# Altium schematic sheet MCU_Hydro.SchDoc
size A4; SheetNumber: 6
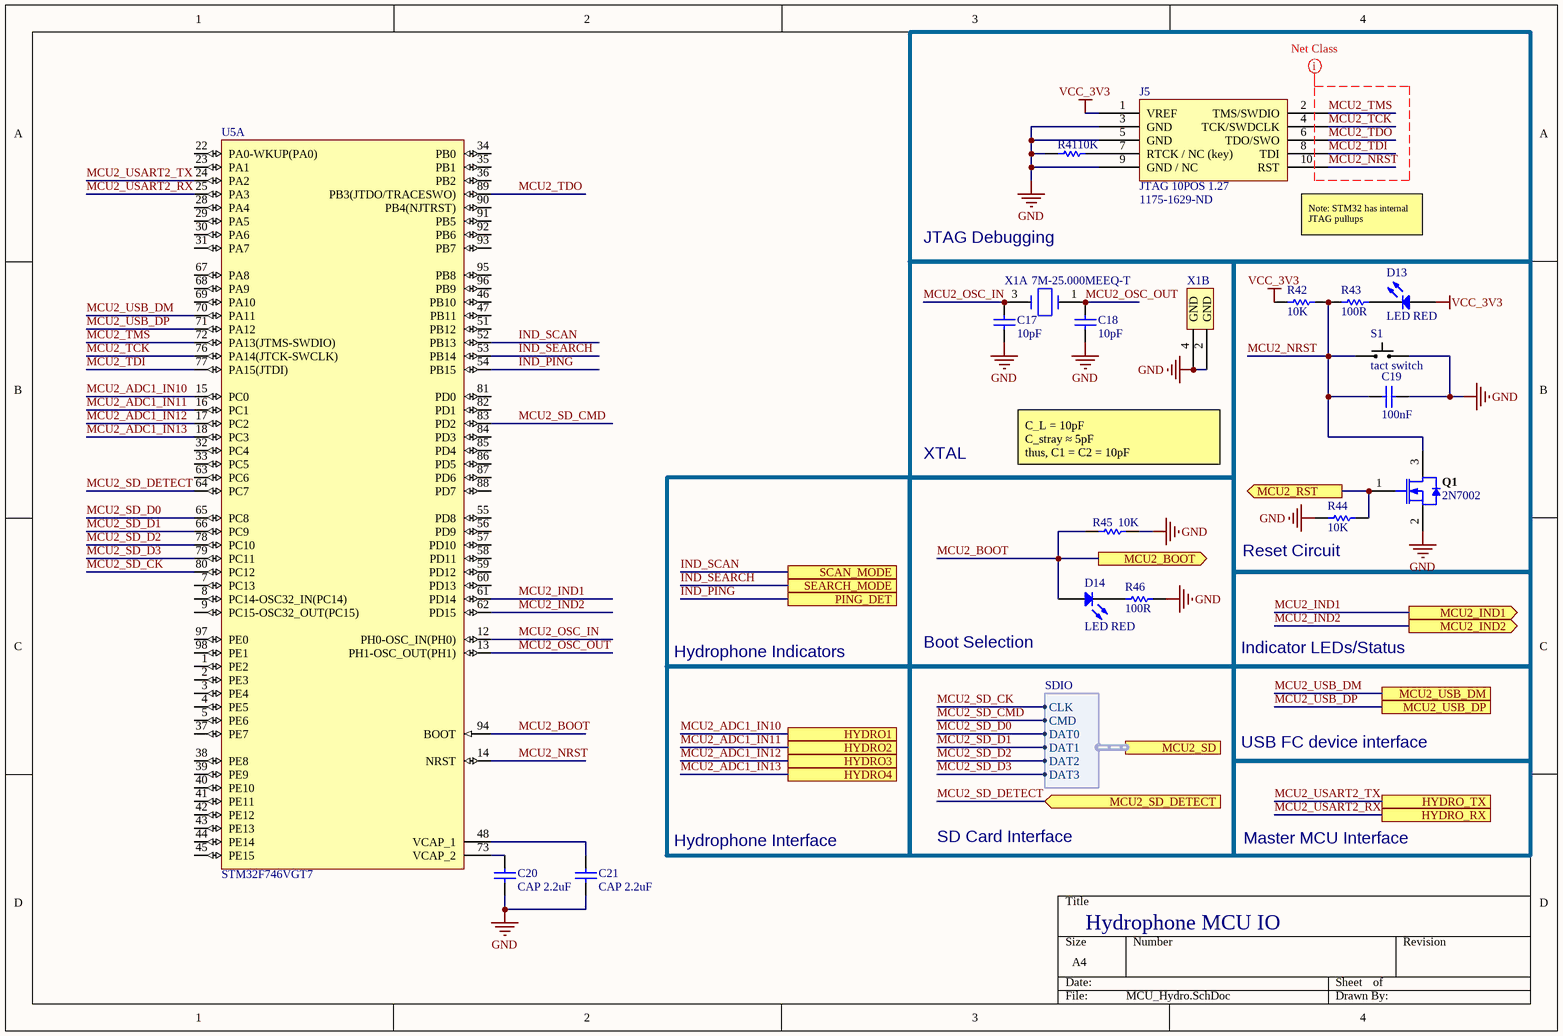
[diagram p0: MCU_Hydro.SchDoc]

## Parts
C17  10pF  [CAPC0603(1608)100_N]
C18  10pF  [CAPC0603(1608)100_N]
C19  100nF  [CAPC0603(1608)100_N]
C20  CAP 2.2uF  [CAPC0603(1608)100_N]
C21  CAP 2.2uF  [CAPC0603(1608)100_N]
D13  LED RED  [LED_0805]
D14  LED RED  [LED_0805]
J5  JTAG 10POS 1.27  Supplier Part Number 1: 1175-1629-ND  [5x2 JTAG SMD]
Q1  2N7002  [INF-PG-SOT23_M]
R41  10K  [RESC0603(1608)_N]
R42  10K  [RESC0603(1608)_N]
R43  100R  [RESC0603(1608)_N]
R44  10K  [RESC0603(1608)_N]
R45  10K  [RESC0603(1608)_N]
R46  100R  [RESC0603(1608)_N]
S1  tact switch  [EVP-AA202K]
U5  STM32F746VGT7  [STM-LQFP100_L]  (part A of 2)
X1  7M-25.000MEEQ-T  [OSCSC320X250X100N]  (parts A,B of 2)

## Blocks framed on the sheet
JTAG Debugging: J5 R41
Reset Circuit: C19 D13 Q1 R42-R44 S1

## Ports
HYDRO1, HYDRO2, HYDRO3, HYDRO4, HYDRO_RX, HYDRO_TX, MCU2_BOOT (out), MCU2_IND1 (out), MCU2_IND2 (out), MCU2_RST (out), MCU2_SD (harness SDIO), MCU2_SD_DETECT (in), MCU2_USB_DM, MCU2_USB_DP, PING_DET, SCAN_MODE, SEARCH_MODE

## Harnesses
SDIO: CLK, CMD, DAT0, DAT1, DAT2, DAT3

## Nets
GND: C17.1 C18.1 C19.1 C20.1 C21.1 J5.3(GND) J5.5(GND) J5.9(GND_/_NC) Q1.2(SOURCE) R41.1 R44.2 R45.2 R46.2 S1.2 X1.2(GND) X1.4(GND)
VCC_3V3: D13.2(A) J5.1(VREF) R42.2
IND_PING: U5.54(PB15) ; port PING_DET
IND_SCAN: U5.52(PB13) ; port SCAN_MODE
IND_SEARCH: U5.53(PB14) ; port SEARCH_MODE
MCU2_ADC1_IN10: U5.15(PC0) ; port HYDRO1
MCU2_ADC1_IN11: U5.16(PC1) ; port HYDRO2
MCU2_ADC1_IN12: U5.17(PC2) ; port HYDRO3
MCU2_ADC1_IN13: U5.18(PC3) ; port HYDRO4
MCU2_BOOT: D14.2(A) R45.1 U5.94(BOOT) ; port MCU2_BOOT
MCU2_IND1: U5.61(PD14) ; port MCU2_IND1
MCU2_IND2: U5.62(PD15) ; port MCU2_IND2
MCU2_NRST: C19.2 J5.10(RST) Q1.3(DRAIN) R42.1 R43.2 S1.1 U5.14(NRST)
MCU2_OSC_IN: C17.2 U5.12(PH0-OSC_IN(PH0)) X1.3
MCU2_OSC_OUT: C18.2 U5.13(PH1-OSC_OUT(PH1)) X1.1
MCU2_RST: Q1.1(GATE) R44.1 ; port MCU2_RST
MCU2_SD_CK: U5.80(PC12) ; port MCU2_SD.CLK
MCU2_SD_CMD: U5.83(PD2) ; port MCU2_SD.CMD
MCU2_SD_D0: U5.65(PC8) ; port MCU2_SD.DAT0
MCU2_SD_D1: U5.66(PC9) ; port MCU2_SD.DAT1
MCU2_SD_D2: U5.78(PC10) ; port MCU2_SD.DAT2
MCU2_SD_D3: U5.79(PC11) ; port MCU2_SD.DAT3
MCU2_SD_DETECT: U5.64(PC7) ; port MCU2_SD_DETECT
MCU2_TCK: J5.4(TCK/SWDCLK) U5.76(PA14(JTCK-SWCLK))
MCU2_TDI: J5.8(TDI) U5.77(PA15(JTDI))
MCU2_TDO: J5.6(TDO/SWO) U5.89(PB3(JTDO/TRACESWO))
MCU2_TMS: J5.2(TMS/SWDIO) U5.72(PA13(JTMS-SWDIO))
MCU2_USART2_RX: U5.25(PA3) ; port HYDRO_RX
MCU2_USART2_TX: U5.24(PA2) ; port HYDRO_TX
MCU2_USB_DM: U5.70(PA11) ; port MCU2_USB_DM
MCU2_USB_DP: U5.71(PA12) ; port MCU2_USB_DP
NetC20_2: C20.2 U5.73(VCAP_2)
NetC21_2: C21.2 U5.48(VCAP_1)
NetD13_1: D13.1(K) R43.1
NetD14_1: D14.1(K) R46.1
NetJ5_7: J5.7(RTCK_/_NC_(key)) R41.2

Not connected (* = marked no-connect by the designer): U5 1(PE2) 2(PE3) 3(PE4) 4(PE5) 5(PE6) 7(PC13) 8(PC14-OSC32_IN(PC14)) 9(PC15-OSC32_OUT(PC15)) 22(PA0-WKUP(PA0)) 23(PA1) 28(PA4) 29(PA5) 30(PA6) 31(PA7) 32(PC4) 33(PC5) 34(PB0) 35(PB1) 36(PB2) 37(PE7) 38(PE8) 39(PE9) 40(PE10) 41(PE11) 42(PE12) 43(PE13) 44(PE14) 45(PE15) 46(PB10) 47(PB11) 51(PB12) 55(PD8) 56(PD9) 57(PD10) 58(PD11) 59(PD12) 60(PD13) 63(PC6) 67(PA8) 68(PA9) 69(PA10) 81(PD0) 82(PD1) 84(PD3) 85(PD4) 86(PD5) 87(PD6) 88(PD7) 90(PB4(NJTRST)) 91(PB5) 92(PB6) 93(PB7) 95(PB8) 96(PB9) 97(PE0) 98(PE1)

## Layout directives
net class JTAG: MCU2_NRST, MCU2_TCK, MCU2_TDI, MCU2_TDO, MCU2_TMS

## Notes on the sheet
- (near J5) Note: STM32 has internal JTAG pullups
- XTAL
- C_L = 10pF
  C_stray ≈ 5pF
  thus, C1 = C2 = 10pF
- Boot Selection
- Indicator LEDs/Status
- Hydrophone Indicators
- USB FC device interface
- Hydrophone Interface
- SD Card Interface
- Master MCU Interface
- Hydrophone MCU IO

## Library data of the parts
C17 C18 = CMP-1035-00549-1: CAP 10pF 25V ±1% 0603 (1608 Metric) Thickness 1mm SMD; Case-EIA: 0603; Case-Metric: 1608; Tolerance: Â±1%; Technology: SMT; Max Thickness: 1 mm; Value: 10pF; Rated Voltage: 25 V
C19 = CMP-1035-02580-1: CAP 100nF 10V ±10% 0603 (1608 Metric) Thickness 1mm SMD; Tolerance: Â±10%; Case-EIA: 0603; Case-Metric: 1608; Max Thickness: 1 mm; Value: 100nF; Rated Voltage: 10 V; Technology: SMT
C20 C21 = CMP-1035-02758-1: CAP 2.2uF 10V ±10% 0603 (1608 Metric) Thickness 1mm SMD; Case-EIA: 0603; Case-Metric: 1608; Tolerance: Â±10%; Rated Voltage: 10 V; Value: 2.2uF; Max Thickness: 1 mm; Technology: SMT
D13 D14 = LED0: led; Manufacturer: Lite-On Inc.; Manufacturer Part Number: LTST-C171KRKT; Lens Color: Colorless; Lens Transparency: Clear; Millicandela Rating: 54mcd; Lens Style/Size: Rectangle with Flat Top, 1.40mm x 1.25mm; Voltage - Forward (Vf) (Typ): 2V; Current - Test: 20mA; Viewing Angle: 130°; Wavelength - Dominant: 631nm; Wavelength - Peak: 639nm; Supplier 1: Digi-Key; Supplier Part Number 1: 160-1427-1-ND; RoHS: RoHS Compliant; Category: Optoelectronics; Stock 1: 260544; Pricing 1: 1=0.31, 10=0.225, 25=0.1656, 100=0.1183, 250=0.0804, 500=0.07096, 1000=0.05558 (USD); Packaging: Cut Tape (CT); Part Status: Active; Color: Red; Mounting Type: Surface Mount; Features: -; Package / Case: 0805 (2012 Metric); Size / Dimension: 2.00mm L x 1.25mm W; Height (Max): 0.80mm; ComponentLink1URL: http://optoelectronics.liteon.com/upload/download/DS22-2000-109/LTST-C171KRKT.pdf; ComponentLink1Description: http://optoelectronics.liteon.com/upload/download/DS22-2000-109/LTST-C171KRKT.pdf
J5 = jtag 10pos mini: Supplier 1: Digi-Key
Q1 = CMP-1149-00026-1: N-Channel OptiMOS Small-Signal-Transistor, 60 V VDS, 0.3 A ID, -55 to 150 degC, PG-SOT23, Reel, Green; Manufacturer: Infineon; RDS (on) (max) (@4.5V): 4,000 mOhm; VDS (max): 60 V; IDpuls (max): 1.2Â A; QG: 0.4Â nC; RDS (on) (max): 3,000 mOhm; RthJA (max): 250 K/W; ID (max): 0.3Â A; VGS(th) (max): 2.5Â V; VGS(th) (min): 1.5Â V; Green: TRUE; Ptot (max): 0.5Â W; PackageDescription: 3-Pin Small Outline Transistor Package, 2.9 x 1.3 mm Body, 0.95 mm Pitch; Halogen-free: TRUE; ComponentLink2Description: Datasheet; ComponentLink1URL: http://www.infineon.com/; Packing: Reel; DatasheetVersion: Rev. 2.4; PartNumber: 2N7002; PackageReference: PG-SOT23; PackageVersion: Apr-08; ComponentLink3URL: http://www.infineon.com/dgdl/SOT23-Package_Overview.pdf?folderId=db3a30431936bc4b0119532290053c66&fileId=db3a30431936bc4b0119533468123c85; ComponentLink1Description: Manufacturer URL; Mounting Technology: Surface Mount; ComponentLink3Description: Package Specification; ComponentLink2URL: http://www.infineon.com/dgdl/2N7002_Rev2.4.pdf?folderId=db3a3043156fd573011622e10b5c1f67&fileId=db3a304319bc939a0119c2a9461e79e6
R41 R42 R44 R45 = CMP-1012-00098-1: 10K 0.1W 5% 0603 (1608 Metric)  SMD; Case-EIA: 0603; Value: 10000.00 Ohm; Case-Metric: 1608; Technology: SMT; Tolerance: 5 %; Power: 0.1 W
R43 R46 = CMP-1012-00050-1: 100R 0.1W 5% 0603 (1608 Metric)  SMD; Case-EIA: 0603; Value: 100.00 Ohm; Case-Metric: 1608; Tolerance: 5 %; Technology: SMT; Power: 0.1 W
S1 = EVP-AA Switch: EVP-AA Momentary Switch SPST-NO; Part Number: EVP-AA202K; Supplier 1: Digi-Key; Supplier Part Number 1: P13348SCT-ND; Datasheet: http://industrial.panasonic.com/lecs/www-data/pdf/ATK0000/ATK0000CE26.pdf
U5 = CMP-1572-00044-1: ARM Cortex-M4 32-bit MCU+FPU, 1024 KB Flash, 320 KB Internal RAM, 82 I/Os, 100-Pin LQFP, -40 to 105 degC, Tray; FLASH Size (Prog) (kB): 1024; Internal RAM Size (kB): 320; I/Os (High Current): 82; Core: ARM Cortex-M7; Operating Frequency(F) (Processor speed) (MHz): 216; D/A Converter: 2; Supply Voltage(Vcc) min (V): 1.7; ComponentLink2Description: Datasheet; Package Reference: LQFP100; ComponentLink1URL: http://www.st.com/; Mounting Technology: Surface Mount; DatasheetVersion: Rev. 2; Package Description: 100-Pin Low Profile Quad Flat Package, Body 14 x 14 mm, Pitch 0.5 mm; ComponentLink1Description: Manufacturer URL; ComponentLink2URL: http://www.st.com/st-web-ui/static/active/en/resource/technical/document/datasheet/DM00166116.pdf; Packing: Tray
X1 = 7M-25.000MEEQ-T: CRYSTAL 25.0000MHZ 10PF SMD; Manufacturer 1: TXC; Frequency: 25MHz; Frequency Tolerance: 10ppm; ESR (Equivalent Series Resistance): 60R; Supplier 1: Digi-Key; Supplier Part Number 1: 887-1326-1-ND; Manufacturer Part Number 1: 7M-25.000MEEQ-T; Stock 1: 17097; Pricing 1: 1=1.27, 10=1.209, 50=1.1812, 100=1.0125, 500=0.9844, 1000=0.8297 (USD); Mount: Surface Mount; Case/Package: SMD/SMT; Number of Pins: 4; Min Operating Temperature: -20°C; Max Operating Temperature: 70°C; Load Capacitance: 10pF; Packaging: Tape and Reel; Package Quantity: 3000; Tolerance: 10ppm; Frequency Stability: 10ppm; Termination: SMD/SMT; Length: 3.2mm; Height: 0.031inch; Width: 0.098inch; Depth: 2.5mm; REACH SVHC: No SVHC; ComponentLink1URL: https://datasheet.ciiva.com/26918/getdatasheetpartid-757227-26918816.pdf; ComponentLink1Description: https://datasheet.ciiva.com/26918/getdatasheetpartid-757227-26918816.pdf; ComponentLink2URL: https://datasheet.ciiva.com/856/7m-accuracy-856022.pdf; ComponentLink2Description: https://datasheet.ciiva.com/856/7m-accuracy-856022.pdf; ComponentLink3URL: https://datasheet.ciiva.com/22658/1794111-22658486.pdf; ComponentLink3Description: https://datasheet.ciiva.com/22658/1794111-22658486.pdf; ComponentLink4URL: https://datasheet.ciiva.com/856/7m-accuracy-856023.pdf; ComponentLink4Description: https://datasheet.ciiva.com/856/7m-accuracy-856023.pdf; ComponentLink5URL: https://datasheet.ciiva.com/856/7m-accuracy-856024.pdf; ComponentLink5Description: https://datasheet.ciiva.com/856/7m-accuracy-856024.pdf; ComponentLink6URL: https://datasheet.ciiva.com/4946/7m-11184-4946126.pdf; ComponentLink6Description: https://datasheet.ciiva.com/4946/7m-11184-4946126.pdf; ComponentLink7URL: https://datasheet.ciiva.com/28498/1794111-28498878.pdf; ComponentLink7Description: https://datasheet.ciiva.com/28498/1794111-28498878.pdf